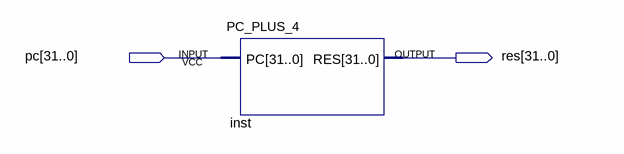
[diagram p0: schematic sheet]
// Quartus schematic PC_PLUS_4TEST.bdf as structural Verilog: 1 symbols, 2 pins
module PC_PLUS_4TEST (
  input  [31:0] pc,
  output [31:0] res
);

  PC_PLUS_4 inst (.PC(pc));  // open: RES
endmodule
